# EAGLE schematic FDT_Main_2021pb2 (EAGLE 7.6.0)
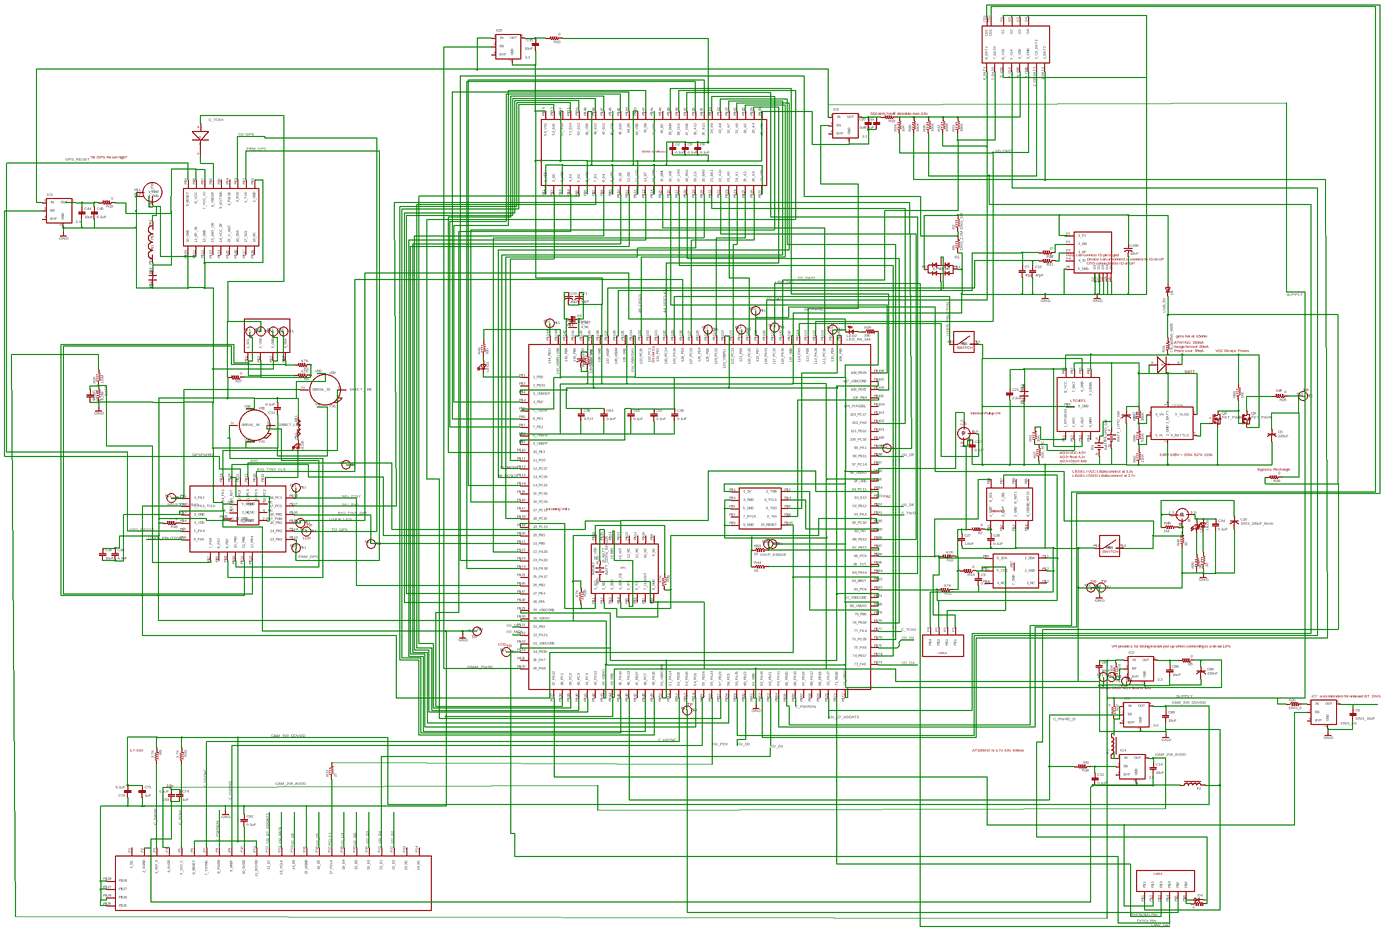
[diagram p0: schematic, sheet 1, overview]
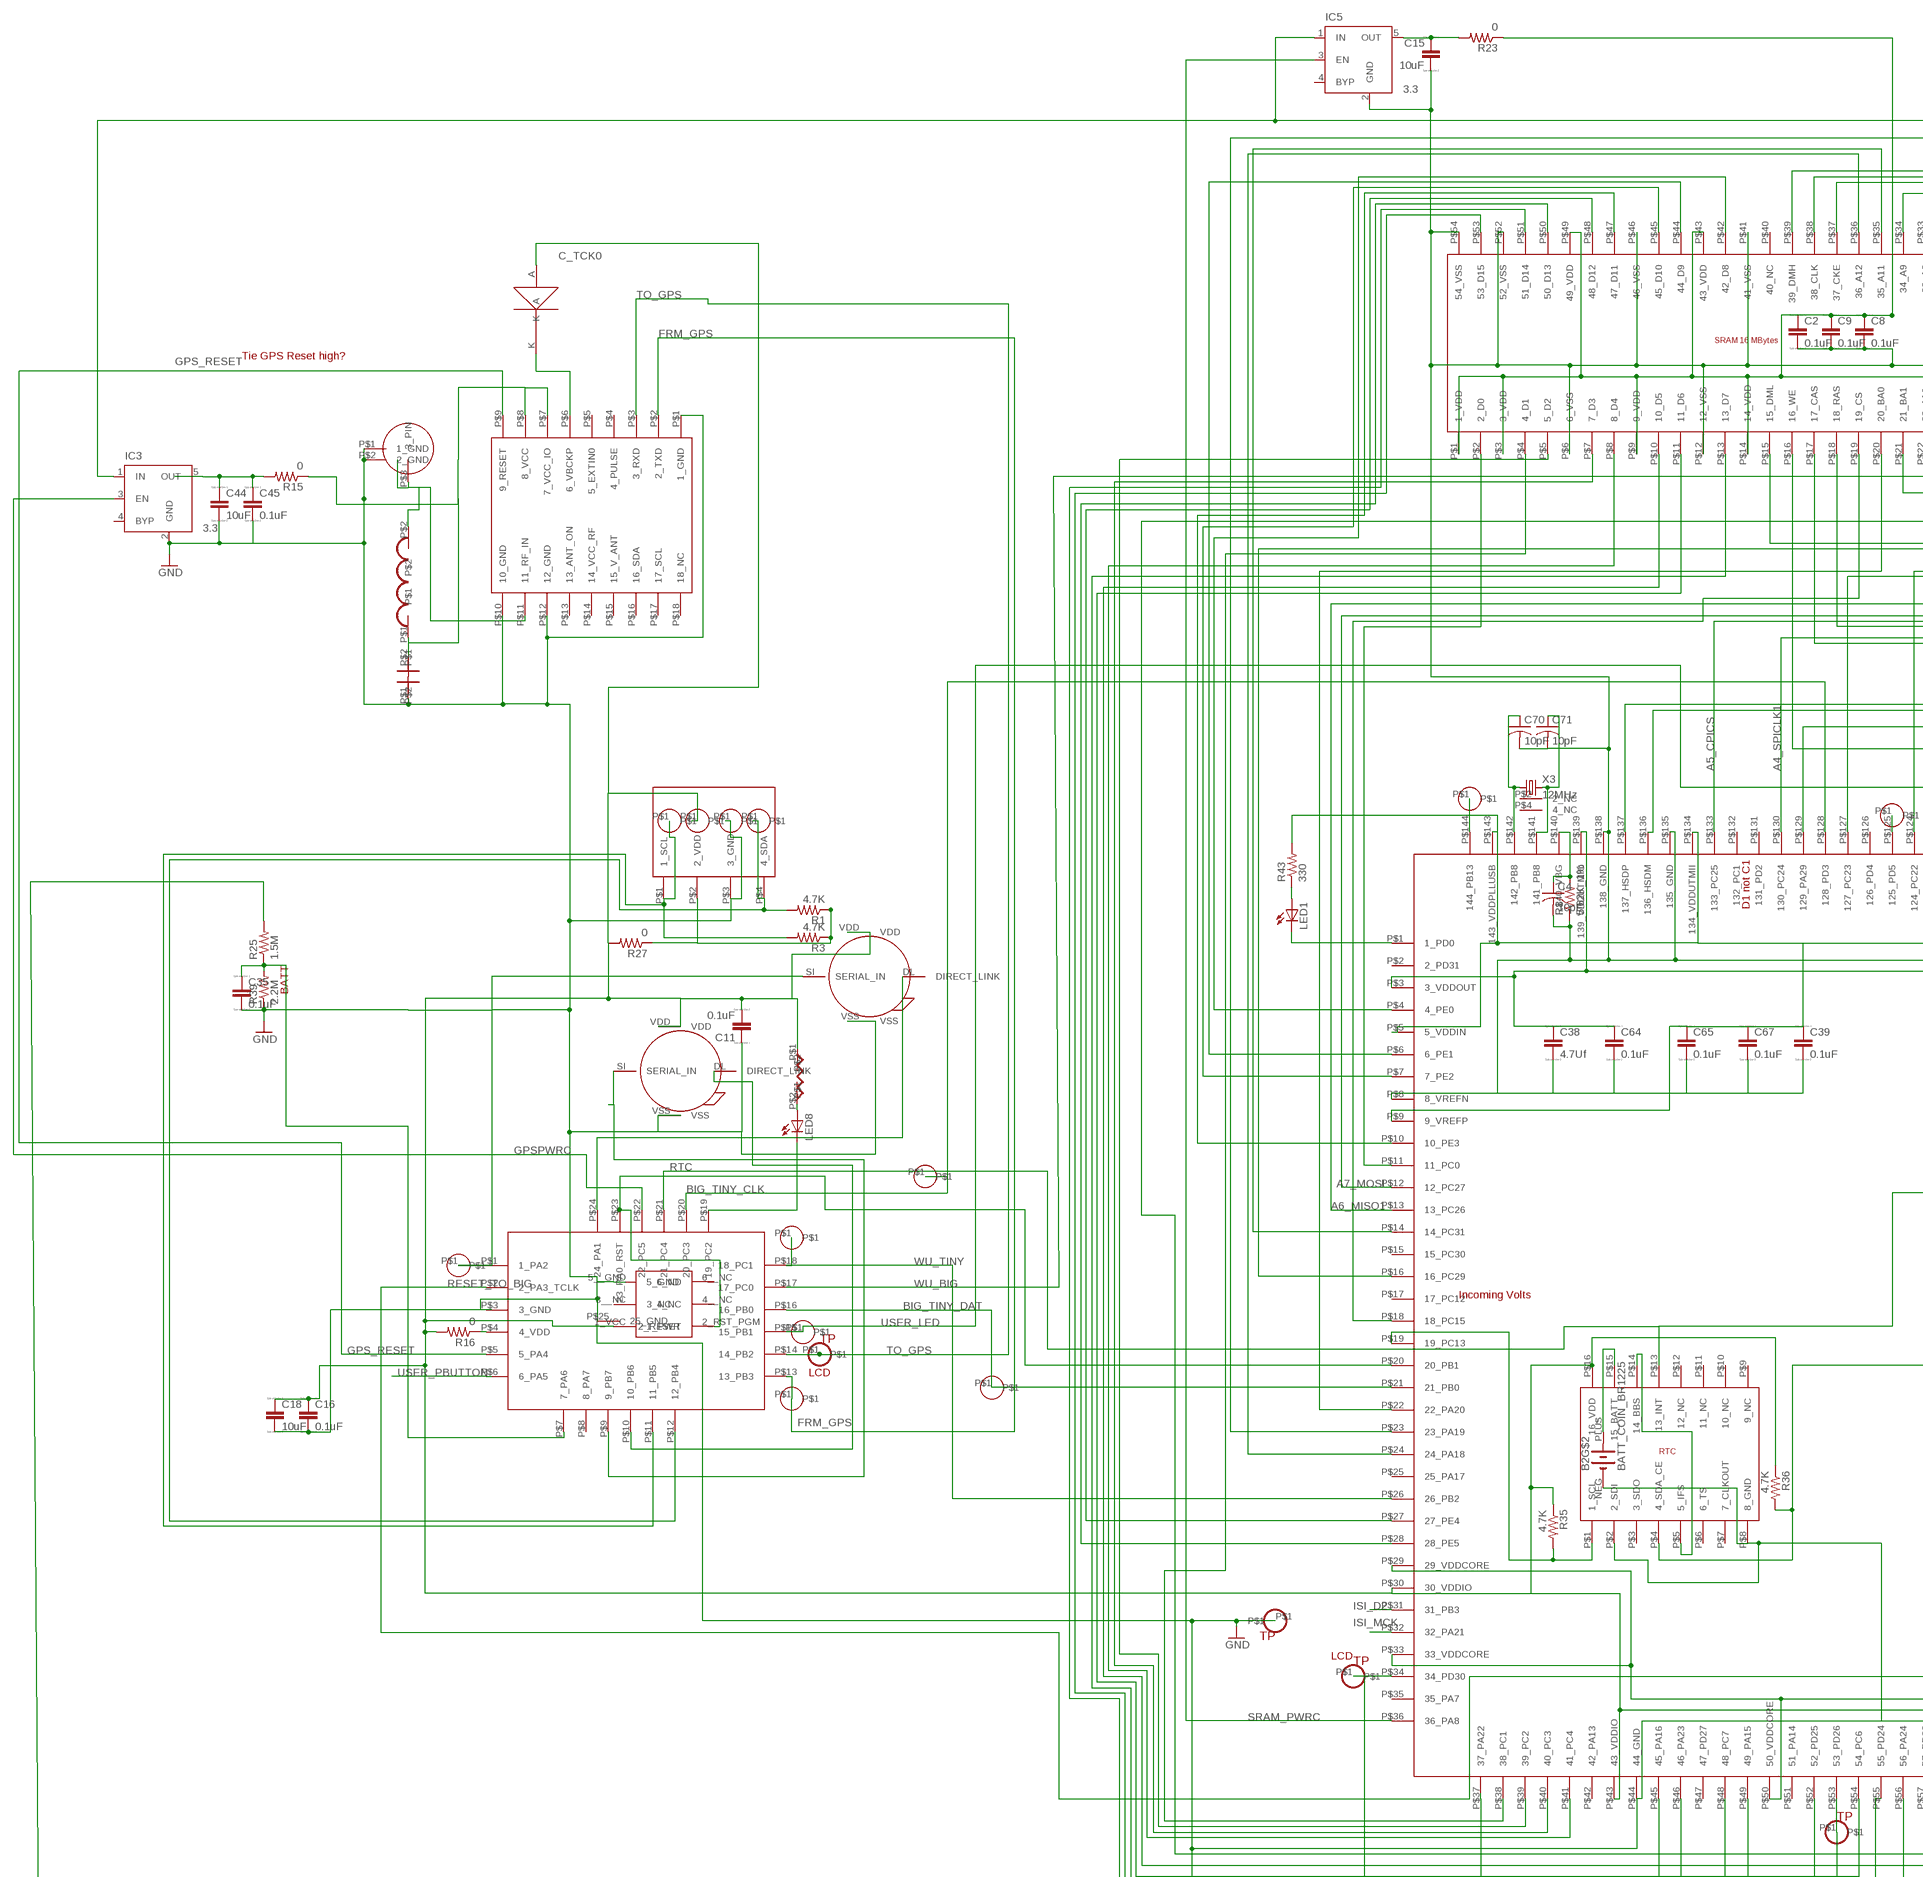
[diagram p1: schematic, sheet 1, part 1 of 4]
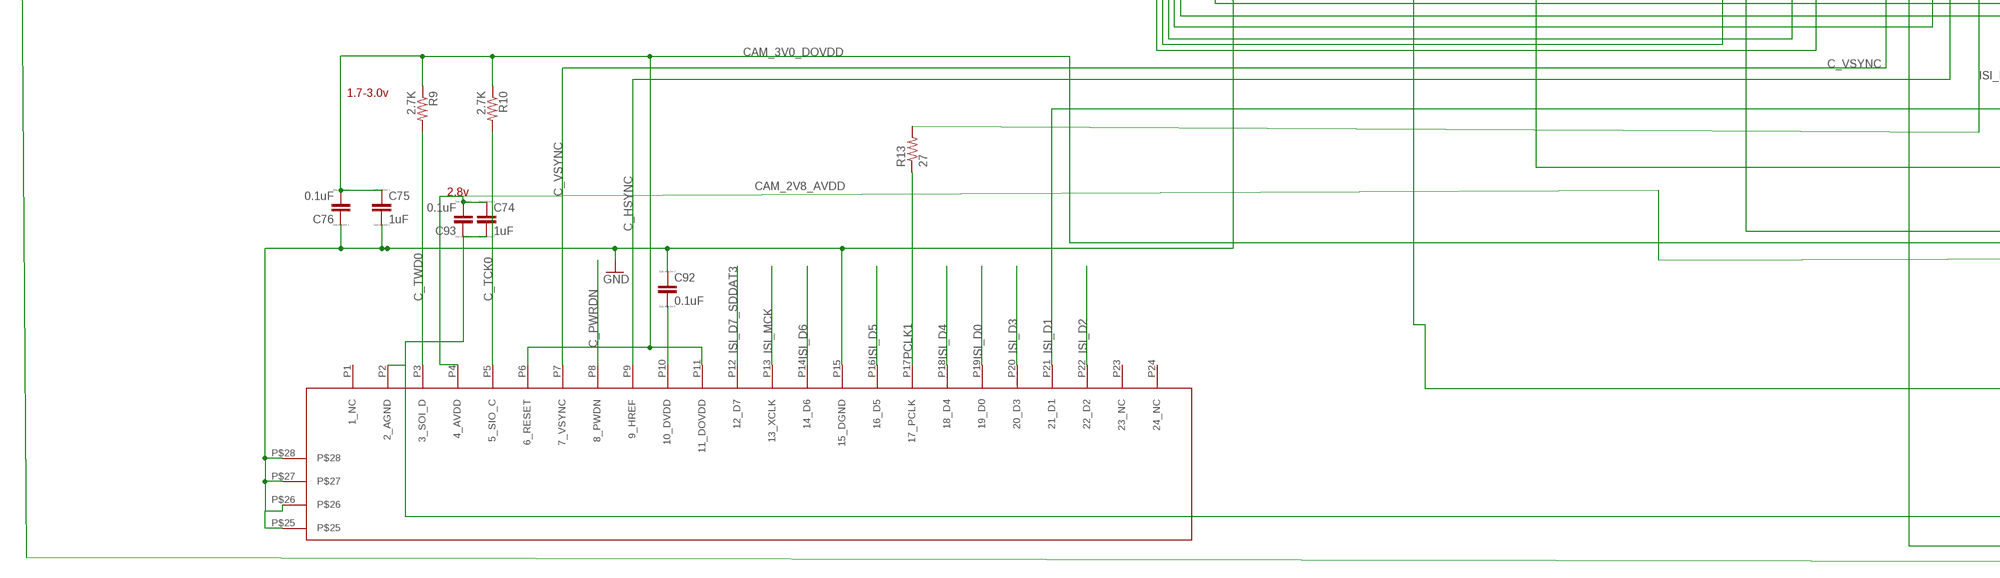
[diagram p2: schematic, sheet 1, part 2 of 4]
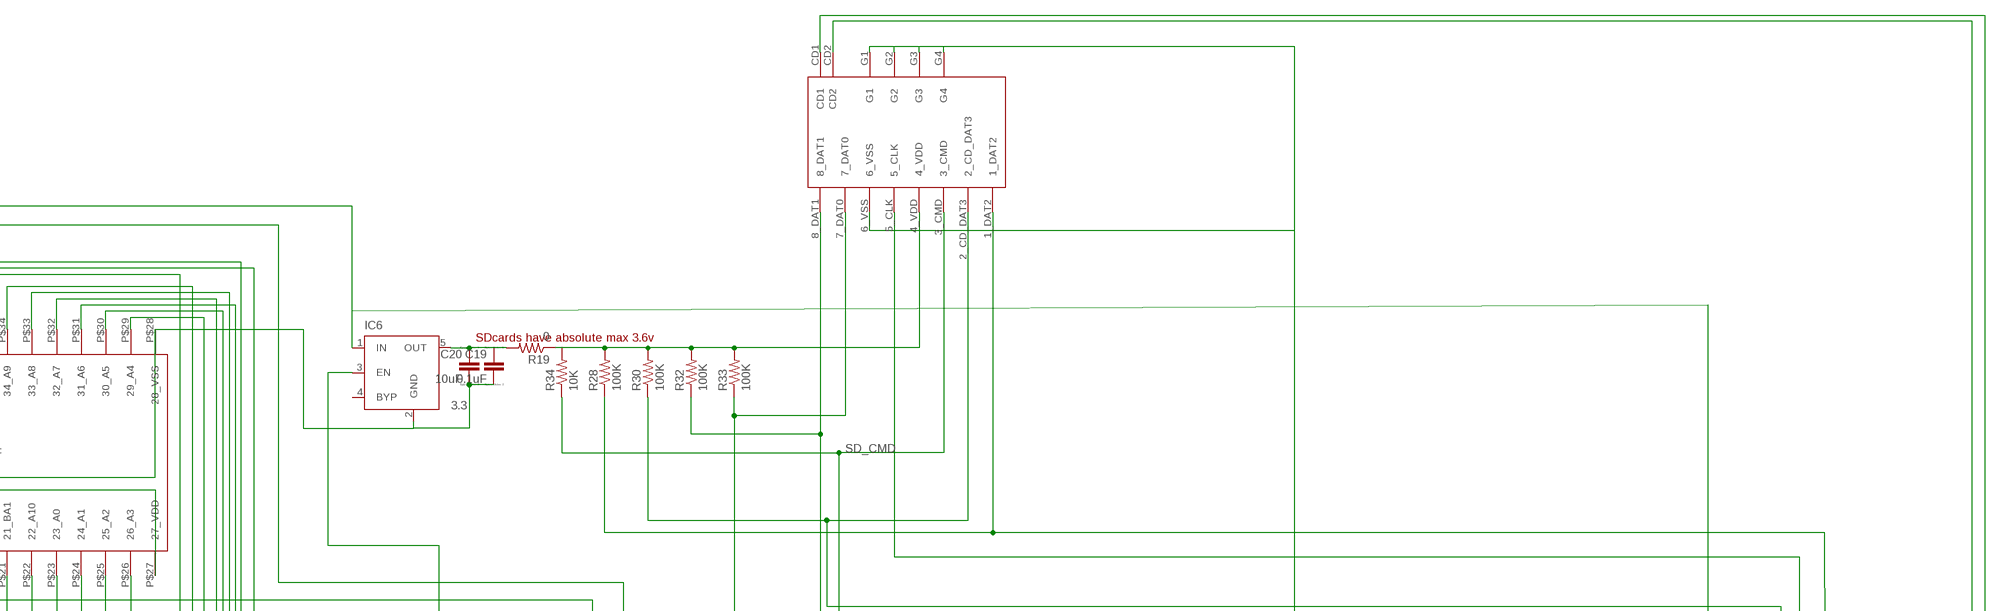
[diagram p3: schematic, sheet 1, part 3 of 4]
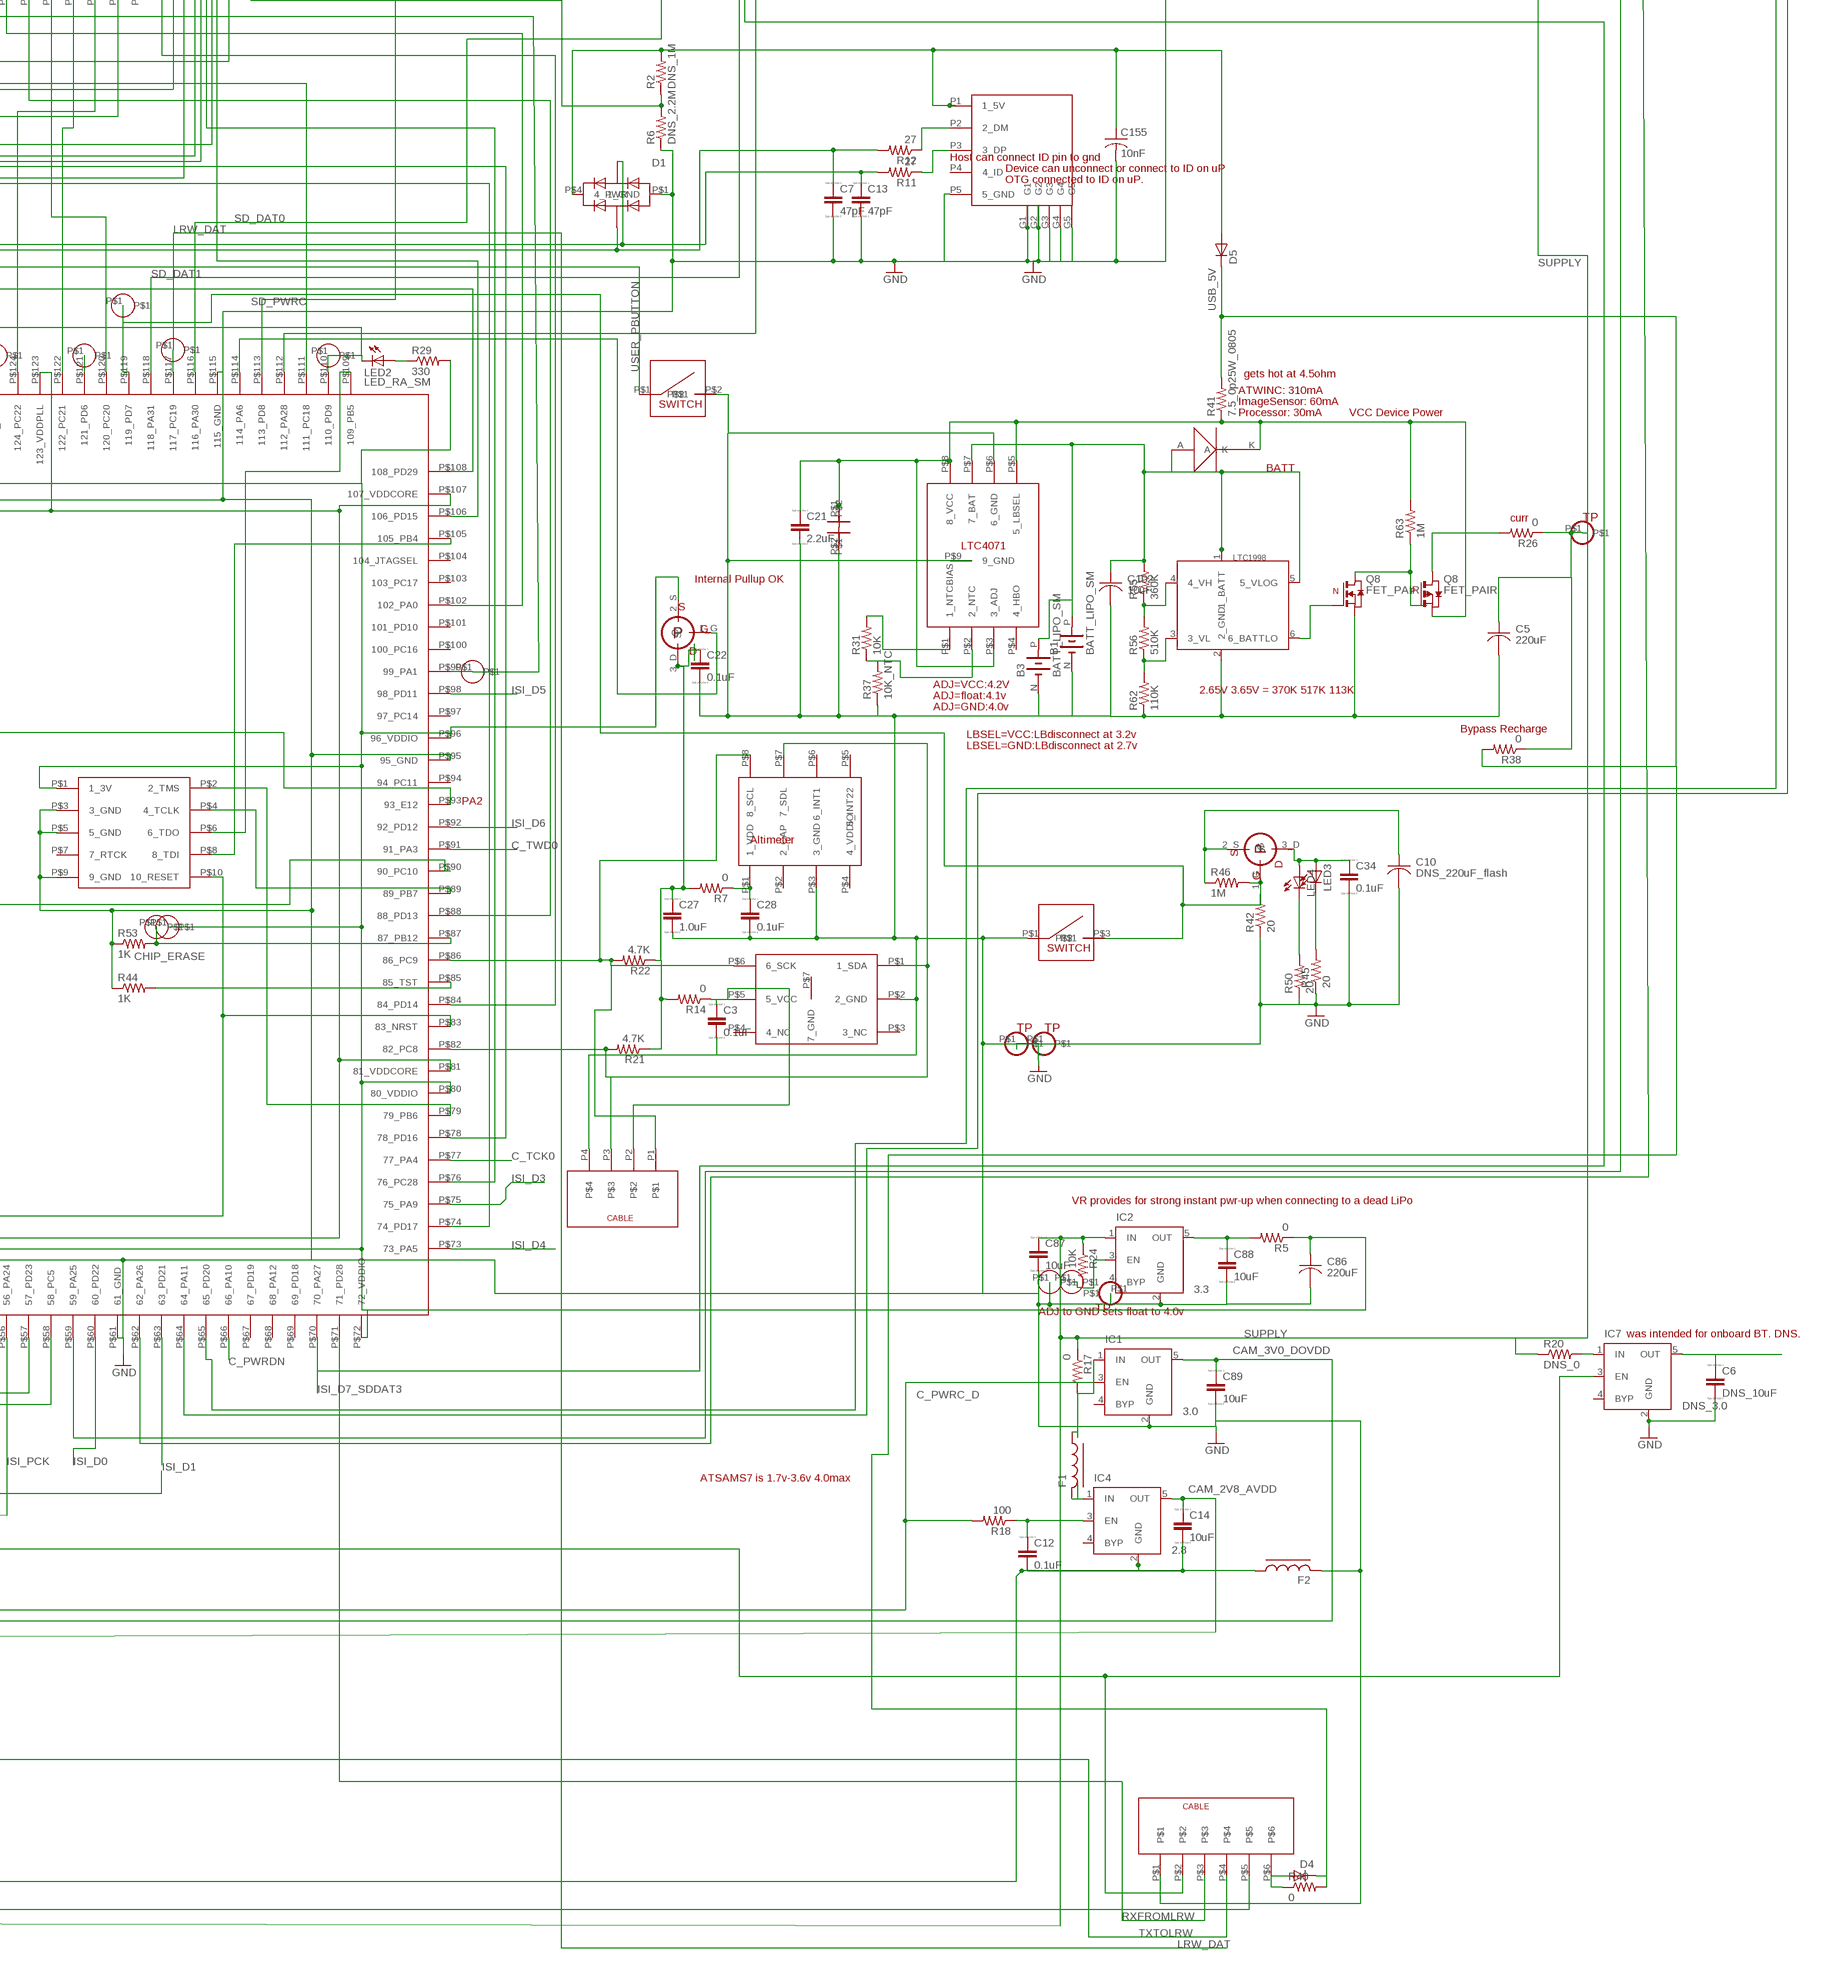
[diagram p4: schematic, sheet 1, part 4 of 4]

## Parts
B1  BATT_LIPO_SM  [BATT_LIPO_SM]
B2  BATT_COIN_BR1225  [BATT_COIN_BR1225]
B3  BATT_LIPO_SM  [BATT_LIPO_SM]
C2  0.1uF  CAP_0402  [C0402]
C3  0.1uF  CAP_0402  [C0402]
C4  10pF  CAP_0402_SM  [SMD_0402]
C5  220uF  CAP_1210  [C1210K]
C6  DNS_10uF  CAP_0603  [C0603]
C7  47pF  CAP_0402  [C0402]
C8  0.1uF  CAP_0402  [C0402]
C9  0.1uF  CAP_0402  [C0402]
C10  DNS_220uF_flash  CAP_1210  [C1210K]
C11  0.1uF  CAP_0402  [C0402]
C12  0.1uF  CAP_0402  [C0402]
C13  47pF  CAP_0402  [C0402]
C14  10uF  CAP_0603  [C0603]
C15  10uF  CAP_0603  [C0603]
C16  0.1uF  CAP_0402  [C0402]
C18  10uF  CAP_0603  [C0603]
C19  0.1uF  CAP_0402  [C0402]
C20  10uF  CAP_0603  [C0603]
C21  2.2uF  CAP_0603  [C0603]
C22  0.1uF  CAP_0402  [C0402]
C27  1.0uF  CAP_0603  [C0603]
C28  0.1uF  CAP_0402  [C0402]
C29  0.1uF  CAP_0402  [SMD_0402]
C34  0.1uF  CAP_0402  [C0402]
C35  0.1uF  CAP_0402  [C0402]
C38  4.7Uf  CAP_0603  [C0603]
C39  0.1uF  CAP_0402  [C0402]
C43  18pF  CAP_0402@2  [SMD_0402]
C44  10uF  CAP_0603  [C0603]
C45  0.1uF  CAP_0402  [C0402]
C64  0.1uF  CAP_0402  [C0402]
C65  0.1uF  CAP_0402  [C0402]
C67  0.1uF  CAP_0402  [C0402]
C70  10pF  CAP_0402_SM  [SMD_0402]
C71  10pF  CAP_0402_SM  [SMD_0402]
C74  1uF  CAP_0603  [C0603]
C75  1uF  CAP_0603  [C0603]
C76  0.1uF  CAP_0402  [C0402]
C86  220uF  CAP_1210  [C1210K]
C87  10uF  CAP_0603  [C0603]
C88  10uF  CAP_0603  [C0603]
C89  10uF  CAP_0603  [C0603]
C92  0.1uF  CAP_0402  [C0402]
C93  0.1uF  CAP_0402  [C0402]
C102  10uF  CAP0805ELEC  [C0805ELEC]
C155  10nF  CAP_0402_SM  [SMD_0402]
D1  ESD_SM  [TVSDIODE]
D2  DIO_SCH  [SOD323]
D3  DIO_SCH  [SOD323]
D4  DIODE_SCHTKY  [SOD323]
D5  DIODE_SCHTKY  [SOD323]
F1  FERRITE_0603  [R0603]
F2  FERRITE_0603  [R0603]
G2  GPS_ANT  [GPS_ANTE]
IC1  3.0  MIC5219XX  [SOT23-5]
IC2  3.3  MIC5219XX  [SOT23-5]
IC3  3.3  MIC5219XX  [SOT23-5]
IC4  2.8  MIC5219XX  [SOT23-5]
IC5  3.3  MIC5219XX  [SOT23-5]
IC6  3.3  MIC5219XX  [SOT23-5]
IC7  DNS_3.0  MIC5219XX  [SOT23-5]
J1  JTAG_KINETIS  [JTAG_KINETIS]
J2  CONN_FPC_24P  [CONN_FPC_24PIN]
J3  MICRO_SD_HORIZ  [MICRO_SD_HORIZ]
J4  USB_MICRO_SMT  [USB_MICRO_2019SMT]
J5  HDR_PGM_TINY_SMT  [HDR_PGM_TINY_SMT]
J6  CONN_4PCABLE_VERT  [CONN_4PCABLE]
J7  CONN_6P_VERT  [CONN_6PCABLE]
L5  100nH  IND_SMD  [SMD_IND]
LED1  LEDCHIP-LED0603  [CHIP-LED0603]
LED2  LED_RA_SM  [LED_RA_SM]
LED3  LED5MM  [LED5MM]
LED4  LED5MM  [LED5MM]
LED8  LEDCHIP-LED0603  [CHIP-LED0603]
PIR1  PIR_DUAL_4P  [PIR_4P]
PIR2  PIR_DUAL_4P  [PIR_4P]
Q1  MOSFET_P  [SOT23_PFET]
Q5  MOSFET_P  [SOT23_PFET]
Q8  FET_PAIR  [SSOT6]
R1  4.7K  R0402  [R0402]
R2  DNS_1M  R0402  [R0402]
R3  4.7K  R0402  [R0402]
R5  0  R0402  [R0402]
R6  DNS_2.2M  R0402  [R0402]
R7  0  R0402  [R0402]
R8  5.62K_1%  R0402  [R0402]
R9  2.7K  RES_0402  [SMD_0402]
R10  2.7K  RES_0402  [SMD_0402]
R11  27  R0402  [R0402]
R12  27  R0402  [R0402]
R13  27  RES_0402  [SMD_0402]
R14  0  R0402  [R0402]
R15  0  R0402  [R0402]
R16  0  R0402  [R0402]
R17  0  R0402  [R0402]
R18  100  R0402  [R0402]
R19  0  R0402  [R0402]
R20  DNS_0  R0402  [R0402]
R21  4.7K  R0402  [R0402]
R22  4.7K  R0402  [R0402]
R23  0  R0402  [R0402]
R24  10K  R0402  [R0402]
R25  1.5M  R0402  [R0402]
R26  0  R0402  [R0402]
R27  0  R0402  [R0402]
R28  100K  R0402  [R0402]
R29  330  R0402  [R0402]
R30  100K  R0402  [R0402]
R31  10K  R0402  [R0402]
R32  100K  R0402  [R0402]
R33  100K  R0402  [R0402]
R34  10K  R0402  [R0402]
R35  4.7K  R0402  [R0402]
R36  4.7K  R0402  [R0402]
R37  10K_NTC  R0402  [R0402]
R38  0  R0402  [R0402]
R39  2.2M  R0402  [R0402]
R40  0  R0402  [R0402]
R41  7.5_0p25W_0805  R-US_M0805  [M0805]
R42  20  R0402  [R0402]
R43  330  R0402  [R0402]
R44  1K  RES_0402  [SMD_0402]
R45  20  R0402  [R0402]
R46  1M  R0402  [R0402]
R50  20  R0402  [R0402]
R53  1K  RES_0402  [SMD_0402]
R55  360K  R0402  [R0402]
R56  510K  R0402  [R0402]
R62  110K  R0402  [R0402]
R63  1M  R0402  [R0402]
R65  330  RES_0402  [SMD_0402]
SW1  SWITH_NO  [SW_SQ]
T2  TESTP_SM  [TESTP_SM]
T3  TESTP_SM  [TESTP_SM]
T4  TESTP_SM  [TESTP_SM]
T5  TESTP_SM  [TESTP_SM]
T6  TESTP_SM  [TESTP_SM]
T7  TESTP_SM  [TESTP_SM]
T12  TESTP_SM  [TESTP_SM]
T13  TESTP_SM  [TESTP_SM]
TP1  TP_SMT  [TP_SMT]
TP2  TP_SMT  [TP_SMT]
TP3  TP_THSM  [TP_THSM]
TP4  TP_SMT  [TP_SMT]
TP5  TP_THSM  [TP_THSM]
TP6  TP_SMT  [TP_SMT]
TP7  TP_THSM  [TP_THSM]
TP8  TP_THSM  [TP_THSM]
TP9  TP_THSM  [TP_THSM]
TP10  TP_SMT  [TP_SMT]
TP11  TP_THSM  [TP_THSM]
TP12  TP_THSM2  [TP_THSM2]
TP13  TP_THSM2  [TP_THSM2]
TP15  TP_SMT  [TP_SMT]
TP16  TP_SMT  [TP_SMT]
TP17  TP_SMT  [TP_SMT]
TP18  TP_SMT  [TP_SMT]
TP24  TP_SMT  [TP_SMT]
TP26  TP_SMT  [TP_SMT]
TP27  TP_SMT  [TP_SMT]
TP29  TP_SMT  [TP_SMT]
U1  ALTIMETER_NXP  [ALTIMETER_MPL]
U2  ATSAMV71_144  [LQFP144]
U4  HUMIDITY_A  [HUMIDITY_A]
U5  ALS  [ALS]
U6  RTC_2019  [SOIC16_RTC]
U7  SRAM_16M_2X16  [TSOP_54]
U9  LTC4071  [MSOP_8]
U11  UBLOX_M8  [UBLOX_M8]
U19  LTC1998  [SOT23-6L]
U24  ATTINY_817_QFN  [QFN24]
U$1  SWITCH  [SWITCH]
X3  12MHz  XTAL_SMALL  [XTAL_SMALL]

## Nets
A0: U2.P$120(120_PC20) U7.P$23(23_A0)
A1: U2.P$122(122_PC21) U7.P$24(24_A1)
A2: U2.P$124(124_PC22) U7.P$25(25_A2)
A3: U2.P$127(127_PC23) U7.P$26(26_A3)
A4_SPICLK1: U2.P$130(130_PC24) U7.P$29(29_A4)
A5_CPICS: U2.P$133(133_PC25) U7.P$30(30_A5)
A6_MISO1: U2.P$13(13_PC26) U7.P$31(31_A6)
A7_MOSI: U2.P$12(12_PC27) U7.P$32(32_A7)
A8: U2.P$76(76_PC28) U7.P$33(33_A8)
A9: U2.P$16(16_PC29) U7.P$34(34_A9)
A10: U2.P$88(88_PD13) U7.P$22(22_A10)
A11: U2.P$14(14_PC31) U7.P$35(35_A11)
A12: U2.P$24(24_PA18) U7.P$36(36_A12)
AGND: C12.2 C14.2 C74.2 C93.1 F2.1 IC4.2(GND) J2.P2(2_AGND)
ALT_PWRC: Q5.1_G(G) U2.P$114(114_PA6)
BA0: U2.P$22(22_PA20) U7.P$20(20_BA0)
BATT: B1.P(+) B3.P(+) C102.1P D3.A R55.2 U9.P$7(7_BAT) U19.1(1_BATT) U19.5(5_VLOG)
BATT1: C10.1(1P) Q1.2_S(S) R46.1
BIG_TINY_CLK: TP29.P$1 U2.P$128(128_PD3) U24.P$20(20_PC3)
BIG_TINY_DAT: TP27.P$1 U2.P$21(21_PB0) U24.P$16(16_PB0)
C_HSYNC: J2.P9(9_HREF) U2.P$55(55_PD24)
C_PWRC_D: IC1.3(EN) R18.2 U2.P$46(46_PA23)
C_PWRDN: J2.P8(8_PWDN) U2.P$66(66_PA10)
C_TCK0: J2.P5(5_SIO_C) R10.P$2 U2.P$77(77_PA4)
C_TWD0: J2.P3(3_SOI_D) R9.P$2 U2.P$91(91_PA3)
C_VSYNC: J2.P7(7_VSYNC) U2.P$52(52_PD25)
CAM_2V8_AVDD: C14.1 C74.1 C93.2 IC4.5(OUT) J2.P4(4_AVDD)
CAM_3V0_DOVDD: C75.1 C76.2 C89.1 IC1.5(OUT) J2.P6(6_RESET) J2.P11(11_DOVDD) R9.P$1 R10.P$1
CARD_DETECT_A: J3.CD1 U2.P$64(64_PA11)
CARD_DETECT_B: J3.CD2 U2.P$65(65_PD20)
CAS: U2.P$74(74_PD17) U7.P$17(17_CAS)
CHIP_ERASE: R53.P$2 TP7.P$1 U2.P$87(87_PB12)
CK: U2.P$57(57_PD23) U7.P$38(38_CLK)
CKE: U2.P$84(84_PD14) U7.P$37(37_CKE)
CS: U2.P$18(18_PC15) U7.P$19(19_CS)
D0: U2.P$11(11_PC0) U7.P$2(2_D0)
D1: U2.P$38(38_PC1) U7.P$4(4_D1)
D2: U2.P$39(39_PC2) U7.P$5(5_D2)
D3: U2.P$40(40_PC3) U7.P$7(7_D3)
D4: U2.P$41(41_PC4) U7.P$8(8_D4)
D5: U2.P$58(58_PC5) U7.P$10(10_D5)
D6: U2.P$54(54_PC6) U7.P$11(11_D6)
D7: U2.P$48(48_PC7) U7.P$13(13_D7)
D8: U2.P$4(4_PE0) U7.P$42(42_D8)
D9: U2.P$6(6_PE1) U7.P$44(44_D9)
D10: U2.P$7(7_PE2) U7.P$45(45_D10)
D11: U2.P$10(10_PE3) U7.P$47(47_D11)
D12: U2.P$27(27_PE4) U7.P$48(48_D12)
D13: U2.P$28(28_PE5) U7.P$50(50_D13)
D14: U2.P$49(49_PA15) U7.P$51(51_D14)
D15: U2.P$45(45_PA16) U7.P$53(53_D15)
DISABLE_PWR: IC2.3(EN) R24.2 TP13.P$1
DM: C7.1 D1.P$2(2_S2) R12.2 U2.P$136(136_HSDM)
DP: C13.1 D1.P$3(3_S1) R11.2 U2.P$137(137_HSDP)
DVDD_REF: C92.2 J2.P10(10_DVDD)
FRM_GPS: TP2.P$1 U11.P$2(2_TXD) U24.P$13(13_PB3)
GND: B1.N(-) B2.NEG B3.N(-) C2.2 C3.2 C4.P$2 C5.2(2N) C6.2 C7.2 C8.2 C9.2 C10.2(2N) C11.1 C13.2 C15.2 C16.2 C18.2 C19.2 C20.2 C21.2 C22.2 C27.2 C28.2 C29.P$2 C34.2 C35.2 C38.2 C39.2 C43.P$1 C44.2 C45.2 C64.2 C65.2 C67.2 C70.P$2 C71.P$2 C76.1 C86.2(2N) C87.2 C88.2 C89.2 C92.1 C102.2N C155.P$2 D1.P$1(1_GND) F2.2 G2.P$1(1_GND) G2.P$2(2_GND) IC1.2(GND) IC2.2(GND) IC3.2(GND) IC5.2(GND) IC6.2(GND) IC7.2(GND) J1.P$3(3_GND) J1.P$5(5_GND) J1.P$9(9_GND) J2.P15(15_DGND) J2.P$25 J2.P$26 J2.P$27 J2.P$28 J3.6_VSS J3.G1 J3.G2 J3.G3 J3.G4 J4.G1 J4.G2 J4.G3 J4.G4 J4.G5 J4.P5(5_GND) J5.5__GND(5_GND) J6.P4 J7.P$1 PIR1.VSS PIR2.VSS Q8.5(N_S) R6.1 R8.1 R37.1 R39.1 R42.1 R44.P$1 R45.1 R50.1 R53.P$1 R62.1 SW1.P$2 T2.P$1 T3.P$1 T5.P$1 T12.P$1 TP8.P$1 TP12.P$1 U1.P$3(3_GND) U2.P$8(8_VREFN) U2.P$44(44_GND) U2.P$61(61_GND) U2.P$95(95_GND) U2.P$115(115_GND) U2.P$135(135_GND) U2.P$138(138_GND) U4.P$2(2_GND) U5.P$3(3_GND) U6.P$2(2_SDI) U6.P$8(8_GND) U7.P$6(6_VSS) U7.P$12(12_VSS) U7.P$28(28_VSS) U7.P$41(41_VSS) U7.P$46(46_VSS) U7.P$52(52_VSS) U7.P$54(54_VSS) U9.P$6(6_GND) U9.P$9(9_GND) U11.P$1(1_GND) U11.P$10(10_GND) U11.P$12(12_GND) U19.2(2_GND) U24.P$3(3_GND) U24.P$25(25_GND) U$1.P$1
GPS1: G2.P$3(3_PIN) L5.P$2 U11.P$11(11_RF_IN)
GPS_RESET: U11.P$9(9_RESET) U24.P$5(5_PA4)
GPS_VCC_X: C43.P$2 L5.P$1 R15.1 U11.P$7(7_VCC_IO) U11.P$8(8_VCC)
GPSPWRC: IC3.3(EN) U24.P$22(22_PC5)
ISI_D0: J2.P19(19_D0) U2.P$60(60_PD22)
ISI_D1: J2.P21(21_D1) U2.P$63(63_PD21)
ISI_D2: J2.P22(22_D2) U2.P$31(31_PB3)
ISI_D3: J2.P20(20_D3) U2.P$75(75_PA9)
ISI_D4: J2.P18(18_D4) U2.P$73(73_PA5)
ISI_D5: J2.P16(16_D5) U2.P$98(98_PD11)
ISI_D6: J2.P14(14_D6) U2.P$92(92_PD12)
ISI_D7_SDDAT3: J2.P12(12_D7) J3.2_CD_DAT3 R30.1 U2.P$70(70_PA27)
ISI_MCK: J2.P13(13_XCLK) U2.P$32(32_PA21)
ISI_PCK: R13.P$2 U2.P$56(56_PA24)
LDM: U2.P$111(111_PC18) U7.P$15(15_DML)
LED: LED1.C U2.P$1(1_PD0)
LRW_DAT: TP1.P$1 U2.P$117(117_PC19)
LRW_PWRC: IC7.3(EN) J7.P$2 U2.P$37(37_PA22)
N$1: U6.P$5(5_IFS) U6.P$14(14_BBS)
N$2: U2.P$102(102_PA0) U7.P$21(21_BA1)
N$3: D4.2_A(A) J7.P$6 R40.1
N$4: J5.2_RST_PGM(2_RESET) U2.P$20(20_PB1) U24.P$23(23_PA0_RST)
N$5: J1.P$4(4_TCLK) U2.P$89(89_PB7)
N$6: C44.1 C45.1 IC3.5(OUT) R15.2
N$7: J1.P$8(8_TDI) U2.P$105(105_PB4)
N$8: J1.P$6(6_TDO) U2.P$109(109_PB5)
N$9: J1.P$2(2_TMS) U2.P$79(79_PB6)
N$10: C88.1 IC2.5(OUT) R5.2
N$11: C6.1 IC7.5(OUT)
N$12: R16.1 U24.P$4(4_VDD)
N$14: LED2.1_A(A) R29.1
N$15: F1.1 IC1.1(IN) R17.2
N$16: C19.1 C20.1 IC6.5(OUT) R19.2
N$17: C15.1 IC5.5(OUT) R23.2
N$18: LED1.A R43.1
N$19: D2.K U11.P$6(6_VBCKP)
N$20: PIR1.SI(SERIAL_IN) TP6.P$1 U24.P$1(1_PA2)
N$21: C38.1 C64.1 U2.P$3(3_VDDOUT) U2.P$29(29_VDDCORE) U2.P$33(33_VDDCORE) U2.P$50(50_VDDCORE) U2.P$81(81_VDDCORE) U2.P$107(107_VDDCORE) U2.P$123(123_VDDPLL) U2.P$139(139_VDDUTMIC)
N$22: C70.P$1 U2.P$142(142_PB8) X3.P$1(1_XTAL)
N$23: C71.P$1 U2.P$141(141_PB8) X3.P$3(3_XTAL)
N$25: C4.P$1 R8.2 U2.P$140(140_VBG)
N$26: C75.2
N$27: C35.1 R25.1 R39.2 U24.P$7(7_PA6)
N$29: J3.4_VDD R19.1 R28.2 R30.2 R32.2 R33.2 R34.2
N$30: J7.P$5 T7.P$1 U2.P$53(53_PD26)
N$31: PIR1.DL(DIRECT_LINK) U24.P$24(24_PA1)
N$32: R35.2 U2.P$19(19_PC13) U6.P$1(1_SCL)
N$34: C34.1 LED3.A LED4.A Q1.3_D(D)
N$36: C22.1 C27.1 Q5.3_D(D) R7.2 R14.2 R21.1 R22.1
N$38: J4.P2(2_DM) R12.1
N$39: TP17.P$1 U2.P$121(121_PD6)
N$40: R36.2 U2.P$90(90_PC10) U6.P$4(4_SDA_CE)
N$41: TP10.P$1 U2.P$144(144_PB13)
N$44: R2.1 R6.2 U2.P$23(23_PA19)
N$47: C12.1 IC4.3(EN) R18.1
N$48: J4.P3(3_DP) R11.1
N$49: TP15.P$1 U2.P$125(125_PD5)
N$51: C28.1 R7.1 U1.P$1(1_VDD)
N$54: R44.P$2 U2.P$85(85_TST)
N$55: C155.P$1 D1.P$4(4_PWR) D5.2_A(A) J4.P1(1_5V) R2.2
N$56: F1.2 IC4.1(IN)
N$60: U2.P$106(106_PD15) U7.P$39(39_DMH)
N$61: IC7.1(IN) R20.2
N$62: R31.2 U9.P$1(1_NTCBIAS)
N$63: B2.PLUS U6.P$15(15_BATT)
N$64: Q1.1_G(G) R42.2 R46.2 TP16.P$1 U2.P$119(119_PD7) U$1.P$3
N$65: R31.1 R37.2 U9.P$2(2_NTC)
N$67: LED3.K(C) R45.2
N$70: LED4.K(C) R50.2
N$76: LED8.C U24.P$19(19_PC2)
N$77: LED8.A R65.P$2
N$81: R55.1 R56.2 U19.4(4_VH)
N$102: PIR2.SI(SERIAL_IN) U24.P$9(9_PB7)
N$110: R56.1 R62.2 U19.3(3_VL)
N$112: Q8.1(N_G) U19.6(6_BATTLO)
N$114: Q8.3(P_G) Q8.6(N_D) R63.1
N$173: PIR2.DL(DIRECT_LINK) U24.P$10(10_PB6)
PCLK1: J2.P17(17_PCLK) R13.P$1
RAS: U2.P$78(78_PD16) U7.P$18(18_RAS)
RESET_TO_BIG: J1.P$10(10_RESET) U2.P$83(83_NRST) U24.P$2(2_PA3_TCLK)
RTC: U2.P$93(93_E12) U6.P$13(13_INT) U24.P$21(21_PC4)
RXFROMLRW: J7.P$3 U2.P$71(71_PD28)
SCL: J6.P1 R22.2 U1.P$8(8_SCL) U2.P$86(86_PC9) U4.P$6(6_SCK)
SD_CLK: J3.5_CLK U2.P$59(59_PA25)
SD_CMD: J3.3_CMD R34.1 U2.P$112(112_PA28)
SD_DAT0: J3.7_DAT0 R33.1 U2.P$116(116_PA30)
SD_DAT1: J3.8_DAT1 R32.1 U2.P$118(118_PA31)
SD_DAT2: J3.1_DAT2 R28.1 U2.P$62(62_PA26)
SD_PWRC: IC6.3(EN) U2.P$113(113_PD8)
SDA: J6.P3 R21.2 U1.P$7(7_SDL) U2.P$82(82_PC8) U4.P$1(1_SDA)
SENS_PWR: C3.1 J6.P2 R14.1 U4.P$5(5_VCC)
SENSPWR: R1.1 R3.1 R27.1 U5.P$2(2_VDD)
SRAM_PWRC: IC5.3(EN) U2.P$36(36_PA8)
SRAMPWR: C2.1 C8.1 C9.1 R23.1 U7.P$1(1_VDD) U7.P$3(3_VDD) U7.P$9(9_VDD) U7.P$14(14_VDD) U7.P$27(27_VDD) U7.P$43(43_VDD) U7.P$49(49_VDD)
SUPPLY: C5.1(1P) C87.1 IC2.1(IN) IC3.1(IN) IC5.1(IN) IC6.1(IN) R17.1 R20.1 R24.1 R25.2 R26.1 R38.1 T13.P$1
T_SCL: R3.2 TP3.P$1 U5.P$1(1_SCL) U24.P$11(11_PB5)
T_SDA: R1.2 TP11.P$1 U5.P$4(4_SDA) U24.P$12(12_PB4)
TO_GPS: T6.P$1 U11.P$3(3_RXD) U24.P$14(14_PB2)
TXTOLRW: J7.P$4 T4.P$1 U2.P$34(34_PD30)
USB_5V: D4.1_K(K) D5.1_K(K) R38.2 R40.2 R41.2
USER_LED: LED2.2_K(C) TP4.P$1 TP18.P$1 U2.P$110(110_PD9) U24.P$15(15_PB1)
USER_PBUTTON: SW1.P$1 U2.P$129(129_PA29) U24.P$6(6_PA5)
VCC: C11.2 C16.1 C18.1 C39.1 C65.1 C67.1 C86.1(1P) D2.A J1.P$1(1_3V) J5.1_VCC(1_PWR) PIR1.VDD PIR2.VDD Q5.2_S(S) R5.1 R16.2 R27.2 R29.2 R35.1 R36.1 R43.2 R65.P$1 TP5.P$1 TP9.P$1 U2.P$5(5_VDDIN) U2.P$9(9_VREFP) U2.P$30(30_VDDIO) U2.P$43(43_VDDIO) U2.P$72(72_VDDIO) U2.P$80(80_VDDIO) U2.P$96(96_VDDIO) U2.P$134(134_VDDUTMII) U2.P$143(143_VDDPLLUSB) U6.P$16(16_VDD)
VCC1: C21.1 C29.P$1 D3.K Q8.2(P_S) R41.1 R63.2 U9.P$3(3_ADJ) U9.P$5(5_LBSEL) U9.P$8(8_VCC)
VCC9: Q8.4(P_D) R26.2
WE: U2.P$108(108_PD29) U7.P$16(16_WE)
WU_BIG: TP24.P$1 U2.P$99(99_PA1) U24.P$17(17_PC0)
WU_TINY: TP26.P$1 U2.P$26(26_PB2) U24.P$18(18_PC1)
Unconnected: IC1.4(BYP) IC2.4(BYP) IC3.4(BYP) IC4.4(BYP) IC5.4(BYP) IC6.4(BYP) IC7.4(BYP) J1.P$7(7_RTCK) J2.P1(1_NC) J2.P23(23_NC) J2.P24(24_NC) J4.P4(4_ID) J5.3__NC(3_NC) J5.4__NC(4_NC) J5.6__NC(6_ND) U1.P$2(2_CAP) U1.P$4(4_VDDIO) U1.P$5(5_INT22) U1.P$6(6_INT1) U2.P$2(2_PD31) U2.P$15(15_PC30) U2.P$17(17_PC12) U2.P$25(25_PA17) U2.P$35(35_PA7) U2.P$42(42_PA13) U2.P$47(47_PD27) U2.P$51(51_PA14) U2.P$67(67_PD19) U2.P$68(68_PA12) U2.P$69(69_PD18) U2.P$94(94_PC11) U2.P$97(97_PC14) U2.P$100(100_PC16) U2.P$101(101_PD10) U2.P$103(103_PC17) U2.P$104(104_JTAGSEL) U2.P$126(126_PD4) U2.P$131(131_PD2) U2.P$132(132_PC1) U4.P$3(3_NC) U4.P$4(4_NC) U4.P$7(7_GND) U6.P$3(3_SDO) U6.P$6(6_TS) U6.P$7(7_CLKOUT) U6.P$9(9_NC) U6.P$10(10_NC) U6.P$11(11_NC) U6.P$12(12_NC) U7.P$40(40_NC) U9.P$4(4_HBO) U11.P$4(4_PULSE) U11.P$5(5_EXTIN0) U11.P$13(13_ANT_ON) U11.P$14(14_VCC_RF) U11.P$15(15_V_ANT) U11.P$16(16_SDA) U11.P$17(17_SCL) U11.P$18(18_NC) U24.P$8(8_PA7) X3.P$2(2_NC) X3.P$4(4_NC)

## Notes on the sheet
- SDcards have absolute max 3.6v
- Tie GPS Reset high?
- Host can connect ID pin to gnd
- Device can unconnect or connect to ID on uP
- OTG connected to ID on uP.
- gets hot at 4.5ohm
- ATWINC: 310mA
- D1 not C1
- ImageSensor: 60mA
- Processor: 30mA | VCC Device Power
- BATT
- BATT
- curr
- Internal Pullup OK
- ADJ=VCC:4.2V
- 2.65V 3.65V = 370K 517K 113K
- ADJ=float:4.1v
- ADJ=GND:4.0v
- Bypass Recharge
- LBSEL=VCC:LBdisconnect at 3.2v
- LBSEL=GND:LBdisconnect at 2.7v
- PA2
- Incoming Volts
- Altimeter
- LCD
- LCD
- VR provides for strong instant pwr-up when connecting to a dead LiPo
- ADJ to GND sets float to 4.0v
- was intended for onboard BT. DNS.
- 1.7-3.0v | ATSAMS7 is 1.7v-3.6v 4.0max
- 2.8v

## Library data of the parts
B1 B3 = BBox02:BATT_LIPO_SM
B2 = BBox02:BATT_COIN_BR1225
C2 C7-C9 C12 C13 C16 C19 C22 C34 C35 C39 C45 C64 C65 C67 = BBox01:CAP_0402
C3 C11 C28 C76 C92 C93 = BBox02:CAP_0402
C4 C70 C71 C155 = BBox02:CAP_0402_SM
C5 C10 = BBox01:CAP_1210
C6 C14 C15 C18 C20 C21 C27 C38 C44 C74 C75 C87-C89 = BBox02:CAP_0603
C29 = HO3:CAP_0402
C43 = HO2:CAP_0402@2
C86 = BBox02:CAP_1210
C102 = BBox01:CAP0805ELEC
D1 = BBox02:ESD_SM
D2 D3 = HO2:DIO_SCH
D4 D5 = BBox02:DIODE_SCHTKY
F1 F2 = BBox02:FERRITE_0603
G2 = HO2:GPS_ANT
IC1-IC7 = v-reg-micrel:MIC5219XX: VOLTAGE REGULATOR; OC_FARNELL: unknown; OC_NEWARK: unknown
J1 = BBox02:JTAG_KINETIS
J2 = BBox02:CONN_FPC_24P
J3 = BBox02:MICRO_SD_HORIZ
J4 = BBox02:USB_MICRO_SMT
J5 = BBox02:HDR_PGM_TINY_SMT
J6 = BBox02:CONN_4PCABLE_VERT
J7 = BBox02:CONN_6P_VERT
L5 = HO2:IND_SMD
LED1 LED3 LED4 LED8 = led:LED: LED OSRAM: - CHIPLED LG R971, LG N971, LY N971, LG Q971, LY Q971, LO R971, LY R971 LH N974, LH R974 LS Q976, LO Q976, LY Q976 LO Q996 - Hyper CHIPLED LW Q18S LB Q993, LB Q99A, LB R99A - SideLED LS A670, LO A670, LY A670, LG A670, LP A670 LB A673, LV A673, LT A673, LW A673 LH A674 LY A675 LS A676, LA A676, LO A676, LY A676, LW A676 LS A679, LY A679, LG A679 - Hyper Micro SIDELED® LS Y876, LA Y876, LO Y876, LY Y876 LT Y87S - SmartLED LW L88C, LW L88S LB L89C, LB L89S, LG L890 LS L89K, LO L89K, LY L89K LS L896, LA L896, LO L896, LY L896 - TOPLED LS T670, LO T670, LY T670, LG T670, LP T670 LSG T670, LSP T670, LSY T670, LOP T670, LYG T670 LG T671, LOG T671, LSG T671 LB T673, LV T673, LT T673, LW T673 LH T674 LS T676, LA T676, LO T676, LY T676, LB T676, LH T676, LSB T676, LW T676 LB T67C, LV T67C, LT T67C, LS T67K, LO T67K, LY T67K, LW E67C LS E67B, LA E67B, LO E67B, LY E67B, LB E67C, LV E67C, LT E67C LW T67C LS T679, LY T679, LG T679 LS T770, LO T770, LY T770, LG T770, LP T770 LB T773, LV T773, LT T773, LW T773 LH T774 LS E675, LA E675, LY E675, LS T675 LS T776, LA T776, LO T776, LY T776, LB T776 LHGB T686 LT T68C, LB T68C - Hyper Mini TOPLED® LB M676 - Mini TOPLED Santana® LG M470 LS M47K, LO M47K, LY M47K Source: http://www.osram.convergy.de LUXEON: - LUMILED® LXK2-PW12-R00, LXK2-PW12-S00, LXK2-PW14-U00, LXK2-PW14-V00 LXK2-PM12-R00, LXK2-PM12-S00, LXK2-PM14-U00 LXK2-PE12-Q00, LXK2-PE12-R00, LXK2-PE12-S00, LXK2-PE14-T00, LXK2-PE14-U00 LXK2-PB12-K00, LXK2-PB12-L00, LXK2-PB12-M00, LXK2-PB14-N00, LXK2-PB14-P00, LXK2-PB14-Q00 LXK2-PR12-L00, LXK2-PR12-M00, LXK2-PR14-Q00, LXK2-PR14-R00 LXK2-PD12-Q00, LXK2-PD12-R00, LXK2-PD12-S00 LXK2-PH12-R00, LXK2-PH12-S00 LXK2-PL12-P00, LXK2-PL12-Q00, LXK2-PL12-R00 Source: www.luxeon.com KINGBRIGHT: KA-3528ASYC Source: www.kingbright.com
LED2 = BBox02:LED_RA_SM
PIR1 PIR2 = BBox02:PIR_DUAL_4P
Q1 Q5 = BBox02:MOSFET_P
Q8 = BBox01:FET_PAIR
R1-R3 R5-R8 R11 R12 R14-R40 R42 R43 R45 R46 R50 R55 R56 R62 R63 = BBox01:R0402
R9 R10 R13 R44 R53 = BBox02:RES_0402
R41 = resistor:R-US_: RESISTOR, American symbol
R65 = HO2:RES_0402
SW1 = BBox02:SWITH_NO
T2-T7 T12 T13 = HO3:TESTP_SM
TP1 TP2 TP4 TP6 TP10 TP15-TP18 TP24 TP26 TP27 TP29 = BBox02:TP_SMT
TP3 TP5 TP7-TP9 TP11 = BBox02:TP_THSM
TP12 TP13 = BBox02:TP_THSM2
U1 = BBox02:ALTIMETER_NXP
U2 = BBox02:ATSAMV71_144
U4 = BBox02:HUMIDITY_A
U5 = BBox02:ALS
U6 = BBox02:RTC_2019
U7 = BBox02:SRAM_16M_2X16
U9 = HO3:LTC4071
U11 = BBox01:UBLOX_M8
U19 = BBox01:LTC1998
U24 = BBox02:ATTINY_817_QFN
U$1 = HO3:SWITCH
X3 = BBox02:XTAL_SMALL